# Altium project TDA2003.PrjPcb
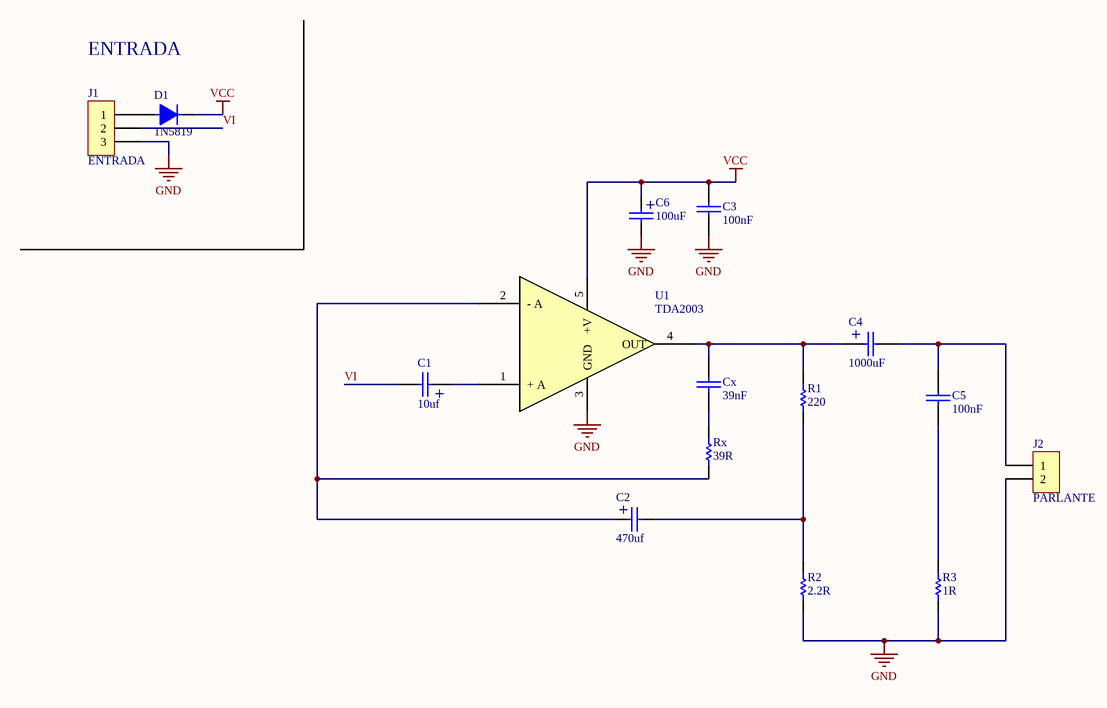
[diagram p0: TDA2003.SchDoc]
1 sheet, 15 parts. Net scope: global (net labels, ports and power ports of the same name join across sheets).
Board files: TDA2003.PcbDoc, panel.PcbDoc

## Sheet TDA2003.SchDoc
size A4

### Parts
C1  10uf  [CAP100RP]
C2  470uf  [CAP300/150]
C3  100nF  [CAP100]
C4  1000uF  [CAP400RP]
C5  100nF  [CAP100]
C6  100uF  [CAP300/150]
Cx  39nF  [CAP100]
D1  1N5819  [DO41]
J1  ENTRADA  [BORNERA3]
J2  PARLANTE  [SIP2]
R1  220  [RES400]
R2  2.2R  [RES400]
R3  1R  [RES400]
Rx  39R  [RES400]
U1  TDA2003  [TO220B]

### Nets
GND: C3.2 C6.2 J1.3 J2.2 R2.1 R3.1 U1.3(GND)
VCC: C3.1 C6.1 D1.2 U1.5(+V)
VI: C1.2 J1.2
NetC1_1: C1.1 U1.1(+_A)
NetC2_1: C2.1 Rx.1 U1.2(-_A)
NetC2_2: C2.2 R1.1 R2.2
NetC4_1: C4.1 Cx.1 R1.2 U1.4(OUT)
NetC4_2: C4.2 C5.1 J2.1
NetC5_2: C5.2 R3.2
NetCx_2: Cx.2 Rx.2
NetD1_1: D1.1 J1.1

### Notes on the sheet
- ENTRADA
- (in symbol CAPPOL) +

### Library data of the parts
C1 C2 C4 C6 = CAPPOL
C3 C5 Cx = CAP
D1 = DIODO
J1 = BORNERA 3
J2 = CON2
R1-R3 Rx = RES
U1 = TDA2003: TDA2003 + DISIPADOR, MICA Y TORNILLO